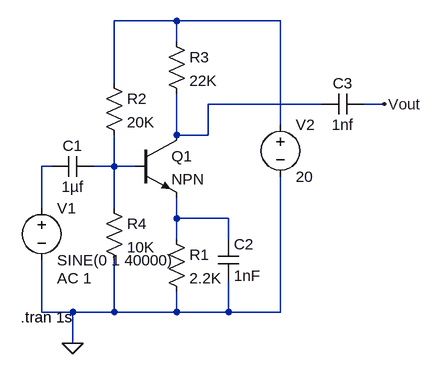
[diagram p0: schematic CommonEmitterAmp1.asc]
CommonEmitterAmp1.asc, the LTspice schematic file:
Version 4
SHEET 1 880 680
WIRE 48 32 -48 32
WIRE 208 32 48 32
WIRE 48 64 48 32
WIRE -48 128 -48 32
WIRE 272 160 96 160
WIRE 368 160 336 160
WIRE 208 192 208 32
WIRE 48 208 48 144
WIRE 96 208 96 160
WIRE 96 208 48 208
WIRE -144 256 -160 256
WIRE -48 256 -48 208
WIRE -48 256 -80 256
WIRE -16 256 -48 256
WIRE -160 320 -160 256
WIRE -48 320 -48 256
WIRE 48 336 48 304
WIRE 128 336 48 336
WIRE 48 368 48 336
WIRE 128 368 128 336
WIRE -160 480 -160 400
WIRE -112 480 -160 480
WIRE -48 480 -48 400
WIRE -48 480 -112 480
WIRE 48 480 48 448
WIRE 48 480 -48 480
WIRE 128 480 128 432
WIRE 128 480 48 480
WIRE 208 480 208 272
WIRE 208 480 128 480
WIRE -112 528 -112 480
FLAG -112 528 0
FLAG 368 160 Vout
SYMBOL npn -16 208 R0
SYMATTR InstName Q1
SYMBOL res 32 352 R0
SYMATTR InstName R1
SYMATTR Value 2.2K
SYMBOL cap 112 368 R0
SYMATTR InstName C2
SYMATTR Value 1nF
SYMBOL voltage -160 304 R0
WINDOW 123 24 124 Left 2
WINDOW 39 0 0 Left 0
SYMATTR Value2 AC 1
SYMATTR InstName V1
SYMATTR Value SINE(0 1 40000)
SYMBOL res -64 112 R0
SYMATTR InstName R2
SYMATTR Value 20K
SYMBOL res 32 48 R0
SYMATTR InstName R3
SYMATTR Value 22K
SYMBOL voltage 208 176 R0
WINDOW 123 24 124 Left 2
WINDOW 39 0 0 Left 0
SYMATTR InstName V2
SYMATTR Value 20
SYMBOL cap -80 240 R90
WINDOW 0 0 32 VBottom 2
WINDOW 3 32 32 VTop 2
SYMATTR InstName C1
SYMATTR Value 1µf
SYMBOL cap 336 144 R90
WINDOW 0 0 32 VBottom 2
WINDOW 3 32 32 VTop 2
SYMATTR InstName C3
SYMATTR Value 1nf
SYMBOL res -64 304 R0
SYMATTR InstName R4
SYMATTR Value 10K
TEXT -192 488 Left 2 !.tran 1s

The netlist it stands for:
* CommonEmitterAmp1.asc
Q1 N002 N004 N005 0 NPN
R1 N005 0 2.2K
C2 N005 0 1nF
V1 N003 0 SINE(0 1 40000) AC 1
R2 N001 N004 20K
R3 N001 N002 22K
V2 N001 0 20
C1 N004 N003 1µf
C3 Vout N002 1nf
R4 N004 0 10K
.model NPN NPN
.model PNP PNP
.lib standard.bjt
.tran 1s
.backanno
.end